# Altium schematic sheet Control Schematic.SchDoc
size A4; SheetNumber: 2; SheetTotal: 2
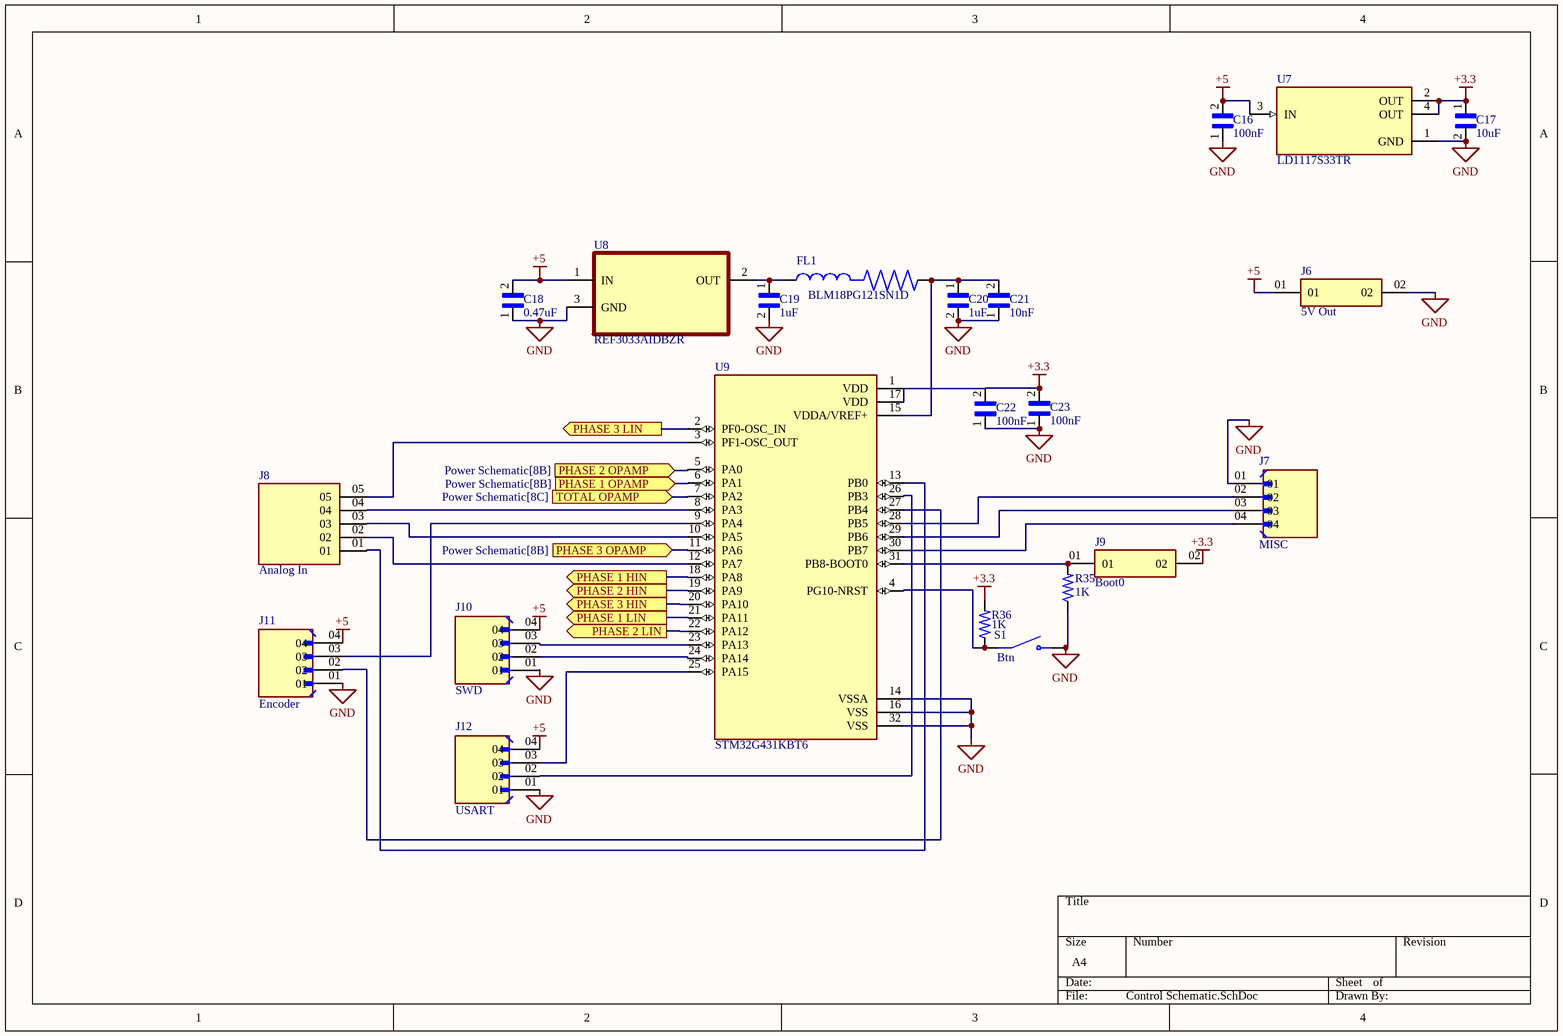
[diagram p0: Control Schematic.SchDoc]

## Parts
C16  100nF  [0603 Footprint]
C17  10uF  [0402 Footprint]
C18  0.47uF  [0603 Footprint]
C19  1uF  [0603 Footprint]
C20  1uF  [0603 Footprint]
C21  10nF  [0402 Footprint]
C22  100nF  [0603 Footprint]
C23  100nF  [0603 Footprint]
FL1  BLM18PG121SN1D  [0603 Footprint]
J6  5V Out  [SAMTEC_MTMM-101-10-G-D-135]
J7  MISC  [WURTH_61300411121]
J8  Analog In  [SAMTEC_TLW-105-06-T-S]
J9  Boot0  [SAMTEC_MTMM-101-10-G-D-135]
J10  SWD  [WURTH_61300411121]
J11  Encoder  [WURTH_61300411121]
J12  USART  [WURTH_61300411121]
R35  1K  [0603 Footprint]
R36  1K  [0603 Footprint]
S1  Btn  [SW_3-1437565-0]
U7  LD1117S33TR  [SOT230P700X180-4N]
U8  REF3033AIDBZR  [SOT95P237X112-3N]
U9  STM32G431KBT6  [QFP80P900X900X160-32N]

## Ports
PHASE 1 HIN (out, see Power Schematic[4A]), PHASE 1 LIN (out, see Power Schematic[4A]), PHASE 1 OPAMP (in, see Power Schematic[8B]), PHASE 2 HIN (out, see Power Schematic[4B]), PHASE 2 LIN (out, see Power Schematic[4B]), PHASE 2 OPAMP (in, see Power Schematic[8B]), PHASE 3 HIN (out, see Power Schematic[4C]), PHASE 3 LIN (out, see Power Schematic[4C]), PHASE 3 OPAMP (in, see Power Schematic[8B]), TOTAL OPAMP (in, see Power Schematic[8C])

## Nets
+3.3: C17.1 C22.2 C23.2 J9.02 R36.2 U7.2(OUT) U7.4(OUT) U9.1(VDD) U9.17(VDD)
+5: C16.2 C18.2 J6.01 J10.04 J11.04 J12.04 U7.3(IN) U8.1(IN)
GND: C16.1 C17.2 C18.1 C19.2 C20.2 C21.1 C22.1 C23.1 J6.02 J7.01 J10.01 J11.01 J12.01 R35.1 S1.3(NO) S1.4(NO) U7.1(GND) U8.3(GND) U9.14(VSSA) U9.16(VSS) U9.32(VSS)
PHASE 1 HIN: U9.18(PA8) ; port PHASE 1 HIN
PHASE 1 LIN: U9.21(PA11) ; port PHASE 1 LIN
PHASE 1 OPAMP: U9.6(PA1) ; port PHASE 1 OPAMP
PHASE 2 HIN: U9.19(PA9) ; port PHASE 2 HIN
PHASE 2 LIN: U9.22(PA12) ; port PHASE 2 LIN
PHASE 2 OPAMP: U9.5(PA0) ; port PHASE 2 OPAMP
PHASE 3 HIN: U9.20(PA10) ; port PHASE 3 HIN
PHASE 3 LIN: U9.2(PF0-OSC_IN) ; port PHASE 3 LIN
PHASE 3 OPAMP: U9.11(PA6) ; port PHASE 3 OPAMP
TOTAL OPAMP: U9.7(PA2) ; port TOTAL OPAMP
NetC19_1: C19.1 FL1.1 U8.2(OUT)
NetC20_1: C20.1 C21.2 FL1.2 U9.15(VDDA/VREF+)
NetJ7_02: J7.02 U9.28(PB5)
NetJ7_03: J7.03 U9.29(PB6)
NetJ7_04: J7.04 U9.30(PB7)
NetJ8_01: J8.01 U9.13(PB0)
NetJ8_02: J8.02 U9.12(PA7)
NetJ8_03: J8.03 U9.10(PA5)
NetJ8_04: J8.04 U9.8(PA3)
NetJ8_05: J8.05 U9.3(PF1-OSC_OUT)
NetJ9_01: J9.01 R35.2 U9.31(PB8-BOOT0)
NetJ10_02: J10.02 U9.24(PA14)
NetJ10_03: J10.03 U9.23(PA13)
NetJ11_02: J11.02 U9.27(PB4)
NetJ11_03: J11.03 U9.9(PA4)
NetJ12_02: J12.02 U9.26(PB3)
NetJ12_03: J12.03 U9.25(PA15)
NetR36_1: R36.1 S1.1(COM) S1.2(COM) U9.4(PG10-NRST)

## Library data of the parts
C16 C22 C23 = 100nF: 0.1ÂµF Â±10% 50V Ceramic Capacitor X7R 0603 _1608 Metric_; MP: CL10B104KB8NNNC; MF: Samsung Electro-Mechanics; Price: None; SnapEDA_Link: https://www.snapeda.com/parts/CL10B104KB8NNNC/Samsung%20Electro-Mechanics/view-part/3598309/?ref=snap; Availability: Unavailable; Package: 0603 Samsung; Value: *
C17 = 10uF: 10ÂµF Â±20% 6.3V Ceramic Capacitor X5R 0402 (1005 Metric); MF: Samsung; MP: CL05A106MQ5NUNC; SnapEDA_Link: https://www.snapeda.com/parts/CL05A106MQ5NUNC/Samsung/view-part/3597832/?ref=snap; Value: *; Availability: Good; Package: 0402 Samsung; DigiKey-Purchase-URL: https://snapeda.com/shop?store=DigiKey&id=3597832; Arrow_Electronics-Purchase-URL: https://snapeda.com/shop?store=Arrow+Electronics&id=3597832; Price: None
C18 = 0.47uF: 0.47ÂµF Â±10% 25V Ceramic Capacitor X7R 0603 (1608 Metric); MP: CL10B474KA8NFNC; MF: Samsung Electro-Mechanics; Check_prices: https://www.snapeda.com/parts/CL10B474KA8NFNC/Samsung%20Electro-Mechanics/view-part/3599462/?ref=eda; Purchase-URL: https://pricing.snapeda.com/search/part/CL10B474KA8NFNC/?ref=eda; Availability: Warning; Package: 0603 Samsung; Price: None; SnapEDA_Link: https://www.snapeda.com/parts/CL10B474KA8NFNC/Samsung%20Electro-Mechanics/view-part/3599462/?ref=snap; Value: *
C19 C20 = 1uF: 1ÂµF Â±10% 25V Ceramic Capacitor X5R 0603 (1608 Metric); MP: CL10A105KA8NNNC; MF: Samsung Electro-Mechanics; Arrow_Electronics-Purchase-URL: https://snapeda.com/shop?store=Arrow+Electronics&id=3597973; Value: *; Arrow_Europe-Purchase-URL: https://snapeda.com/shop?store=Arrow+Europe&id=3597973; SnapEDA_Link: https://www.snapeda.com/parts/CL10A105KA8NNNC/Samsung%20Electro-Mechanics/view-part/3597973/?ref=snap; Digi-Key_Part_Number: 1276-1102-1-ND; Package: 0603 Samsung; DigiKey-Purchase-URL: https://snapeda.com/shop?store=DigiKey&id=3597973
C21 = 10nF: 25V 10nF X7R ±10% 0402 Multilayer Ceramic Capacitors MLCC - SMD/SMT ROHS; MP: CL10B474KA8NFNC; MF: Samsung Electro-Mechanics; Check_prices: https://www.snapeda.com/parts/CL10B474KA8NFNC/Samsung%20Electro-Mechanics/view-part/3599462/?ref=eda; Purchase-URL: https://pricing.snapeda.com/search/part/CL10B474KA8NFNC/?ref=eda; Availability: Warning; Package: 0603 Samsung; Price: None; SnapEDA_Link: https://www.snapeda.com/parts/CL10B474KA8NFNC/Samsung%20Electro-Mechanics/view-part/3599462/?ref=snap; Value: *
FL1 = BLM18PG121SN1D: 120 Ohms @ 100MHz 1 Power Line Ferrite Bead 0603 _1608 Metric_ 2A 50mOhm; MF: Murata; Package: 1608 Murata; Digi-Key_Purchase_URL: https://www.digikey.com/product-detail/en/murata-electronics/BLM18PG121SN1D/490-1037-1-ND/584485?utm_source=snapeda&utm_medium=aggregator&utm_campaign=symbol; Value: *; MP: BLM18PG121SN1D; SnapEDA_Link: https://www.snapeda.com/parts/BLM18PG121SN1D/Murata/view-part/12271/?ref=snap; Digi-Key_Part_Number: 490-1037-1-ND
J6 J9 = 2 Pin Header: Connector Header Through Hole 2 position; MF: Samtec; MP: MTMM-101-10-G-D-135; Availability: In Stock; Value: *; Price: None; Check_prices: https://www.snapeda.com/parts/MTMM-101-10-G-D-135/Samtec/view-part/?ref=eda; Package: None; Purchase-URL: https://pricing.snapeda.com/search/part/MTMM-101-10-G-D-135/?ref=eda; SnapEDA_Link: https://www.snapeda.com/parts/MTMM-101-10-G-D-135/Samtec/view-part/?ref=snap
J7 J10-J12 = 4 Pin Header: Connector Header Through Hole 4 position 0.100 (2.54mm); MF: Wurth Electronics; MP: 61300411121; SnapEDA_Link: https://www.snapeda.com/parts/61300411121/Wurth+Electronics+Inc./view-part/?ref=snap; Package: None; Value: *; Check_prices: https://www.snapeda.com/parts/61300411121/Wurth+Electronics+Inc./view-part/?ref=eda
J8 = 5 Pin Header: MP: TLW-105-06-T-S; Package: None; Price: None; Value: *; Availability: Unavailable
R35 R36 = 1K: 1 kOhms Â±1% 0.1W, 1/10W Chip Resistor 0603 (1608 Metric) Moisture Resistant Thick Film; MF: Yageo; MP: RC0603FR-071KL; SnapEDA_Link: https://www.snapeda.com/parts/RC0603FR-071KL/Yageo/view-part/?ref=snap; Package: 0603 Yageo; Value: *; Check_prices: https://www.snapeda.com/parts/RC0603FR-071KL/Yageo/view-part/?ref=eda
S1 = Btn: Switch Tactile OFF (ON) SPST Round Button Gull Wing 0.05A 24VDC 1VA 9.18N SMD T/R / 3-1437565-0; MF: TE Connectivity; MP: 3-1437565-0; Package: SMD-6 Omron Electronics; Purchase-URL: https://pricing.snapeda.com/search/part/3-1437565-0/?ref=eda; Price: None; Value: *; SnapEDA_Link: https://www.snapeda.com/parts/3-1437565-0/TE%20Connectivity/view-part/294084/?ref=snap; Availability: Good
U7 = LD1117S33TR: Linear Voltage Regulator IC Positive Fixed 1 Output 800mA SOT-223; MF: STMicroelectronics; Value: *; SnapEDA_Link: https://www.snapeda.com/parts/LD1117S33TR/STMicroelectronics/view-part/?ref=snap; MP: LD1117S33TR; Purchase-URL: https://pricing.snapeda.com/search/part/LD1117S33TR/?ref=eda; Check_prices: https://www.snapeda.com/parts/LD1117S33TR/STMicroelectronics/view-part/?ref=eda; Availability: In Stock; Price: None; Package: TO-261-4 STMicroelectronics
U8 = REF3033AIDBZR: Series Voltage Reference IC Â±0.2% SOT-23-3; MF: Texas Instruments; Package: SOT-23-3 Texas Instruments; SnapEDA_Link: https://www.snapeda.com/parts/REF3033AIDBZR/Texas%20Instruments/view-part/298602/?ref=snap; Value: *; Price: None; MP: REF3033AIDBZR; Availability: Unavailable
U9 = STM32G431KBT6: ARMÂ® CortexÂ®-M4F STM32G4 Microcontroller IC 32-Bit 170MHz 128KB _128K x 8_ FLASH 32-LQFP _7x7_; MF: STMicroelectronics; Price: None; SnapEDA_Link: https://www.snapeda.com/parts/STM32G431KBT6/STMicroelectronics/view-part/4422336/?ref=snap; MP: STM32G431KBT6; Availability: Unavailable; Value: *; Package: LQFP-32 STMicroelectronics